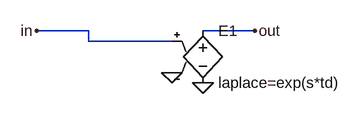
[diagram p0: schematic delay.asc]
delay.asc, the LTspice schematic file:
Version 4
SHEET 1 880 680
WIRE 192 144 112 144
WIRE 448 144 368 144
WIRE 192 160 192 144
WIRE 320 160 192 160
FLAG 112 144 in
FLAG 448 144 out
FLAG 320 208 0
FLAG 368 224 0
SYMBOL e 368 128 R0
SYMATTR InstName E1
SYMATTR Value laplace=exp(s*td)

The netlist it stands for:
* delay.asc
E1 out 0 in 0 laplace=exp(s*td)
.backanno
.end